# EasyEDA Pro project ProPrj_Pollux Marine Drone_2026-04-10.epro

# Schematic Headset
Board Name: Board1; Create Date: 2026-03-25; Page Name: P1; Project Name: Pollux Marine Drone; Schematic Name: Headset; Update Date: 2026-03-25; Company: EasyEDA.com; Page Size: A4; Version: V1.0
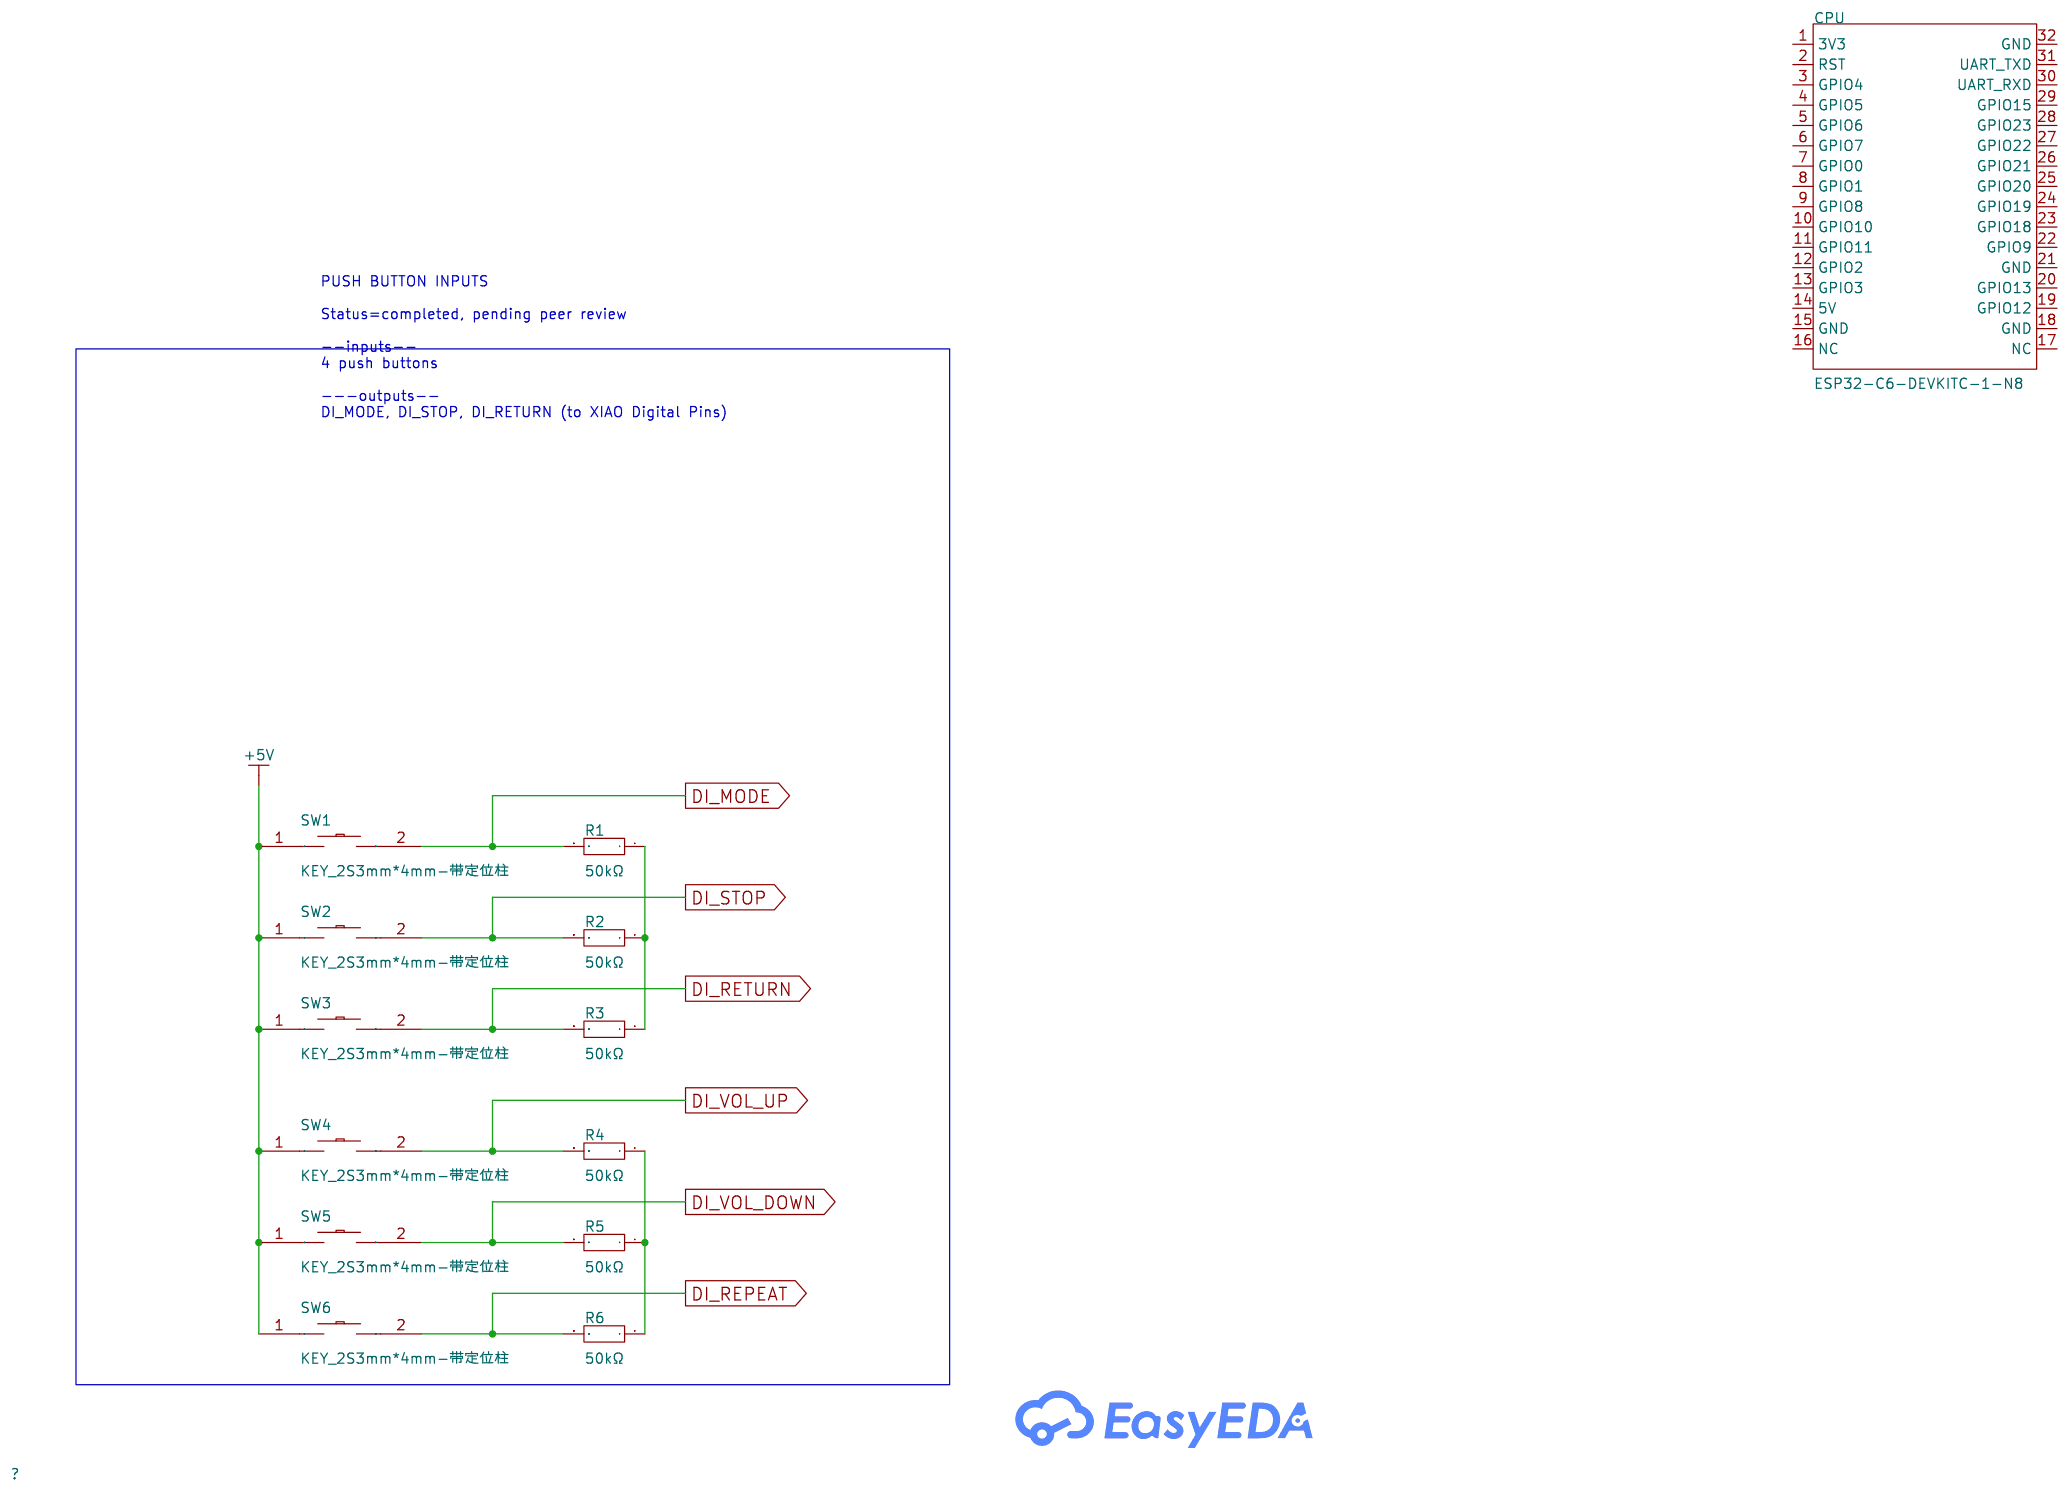
[diagram p0: schematic sheet]

## Parts
CPU  ESP32-C6-DEVKITC-1-N8  [COMM-TH_ESP32-C6-DEVKITC-1-N8]
R1  50kΩ  [R0805]
R2  50kΩ  [R0805]
R3  50kΩ  [R0805]
R4  50kΩ  [R0805]
R5  50kΩ  [R0805]
R6  50kΩ  [R0805]
SW1  KEY_2S3mm*4mm-带定位柱  [KEY-SMD_L4.0-W3.7-LS4.8]
SW2  KEY_2S3mm*4mm-带定位柱  [KEY-SMD_L4.0-W3.7-LS4.8]
SW3  KEY_2S3mm*4mm-带定位柱  [KEY-SMD_L4.0-W3.7-LS4.8]
SW4  KEY_2S3mm*4mm-带定位柱  [KEY-SMD_L4.0-W3.7-LS4.8]
SW5  KEY_2S3mm*4mm-带定位柱  [KEY-SMD_L4.0-W3.7-LS4.8]
SW6  KEY_2S3mm*4mm-带定位柱  [KEY-SMD_L4.0-W3.7-LS4.8]

## Library data of the parts
CPU = ESP32-C6-DEVKITC-1-N8: LCSC Part Name: 不带固件; Supplier Part: C20554022; Manufacturer: ESPRESSIF(乐鑫); JLCPCB Part Class: Extended Part; Datasheet: https://item.szlcsc.com/datasheet/ESP32-C6-DEVKITC-1-N8/21893411.html; Supplier: LCSC
R1-R6 = 0805W8F1002T5E: Type:Thick Film Resistor Resistance:10kΩ Tolerance:±1% Tolerance:±1% Power(Watts):125mW Voltage-Supply(Max):150V Temperature Coefficient:±100ppm/℃ Temperature Coefficient:±100ppm/℃ Operating Temperature:-55℃~+155℃ Operating Temperature:-55℃~+155℃; LCSC Part Name: 10kΩ ±1% 125mW 厚膜电阻; Supplier Part: C17414; Manufacturer: UNI-ROYAL(厚声); Supplier Footprint: 0805; JLCPCB Part Class: Basic Part; Datasheet: https://item.szlcsc.com/datasheet/0805W8F1002T5E/18102.html; Supplier: LCSC; Type: Thick Film Resistor; Tolerance: ±1%; Power(Watts): 125mW; Voltage-Supply(Max): 150V; Temperature Coefficient: ±100ppm/℃; Operating Temperature: -55℃~+155℃
SW1-SW6 = KEY_2S3mm*4mm-带定位柱: Supplier Part: C9900019844; Supplier Footprint: 二脚小乌龟SW_PUSH-带定位柱; JLCPCB Part Class: Extended Part; Supplier: LCSC

## Nets
+5V: SW1.1 SW2.1 SW3.1 SW4.1 SW5.1 SW6.1
GND: R1.1 R2.1 R3.1
DI_MODE: R1.2 SW1.2
DI_REPEAT: R6.2 SW6.2
DI_RETURN: R3.2 SW3.2
DI_STOP: R2.2 SW2.2
DI_VOL_DOWN: R5.2 SW5.2
DI_VOL_UP: R4.2 SW4.2
Net-(R4-1): R4.1 R5.1 R6.1

Not connected (* = marked no-connect by the designer): CPU 1(3V3) 2(RST) 3(GPIO4) 4(GPIO5) 5(GPIO6) 6(GPIO7) 7(GPIO0) 8(GPIO1) 9(GPIO8) 10(GPIO10) 11(GPIO11) 12(GPIO2) 13(GPIO3) 14(5V) 15(GND) 16(NC) 17(NC) 18(GND) 19(GPIO12) 20(GPIO13) 21(GND) 22(GPIO9) 23(GPIO18) 24(GPIO19) 25(GPIO20) 26(GPIO21) 27(GPIO22) 28(GPIO23) 29(GPIO15) 30(UART_RXD) 31(UART_TXD) 32(GND)

## Notes on the sheet
- PUSH BUTTON INPUTS
  Status=completed, pending peer review
  --inputs--
  4 push buttons
  ---outputs--
  DI_MODE, DI_STOP, DI_RETURN (to XIAO Digital Pins)

# Schematic Schematic1
Board Name: Wristband; Create Date: 2026-03-01; Page Name: P1; Project Name: Pollux Marine Drone; Schematic Name: Schematic1; Update Date: 2026-04-07; Company: EasyEDA.com; Page Size: A4; Version: V1.0
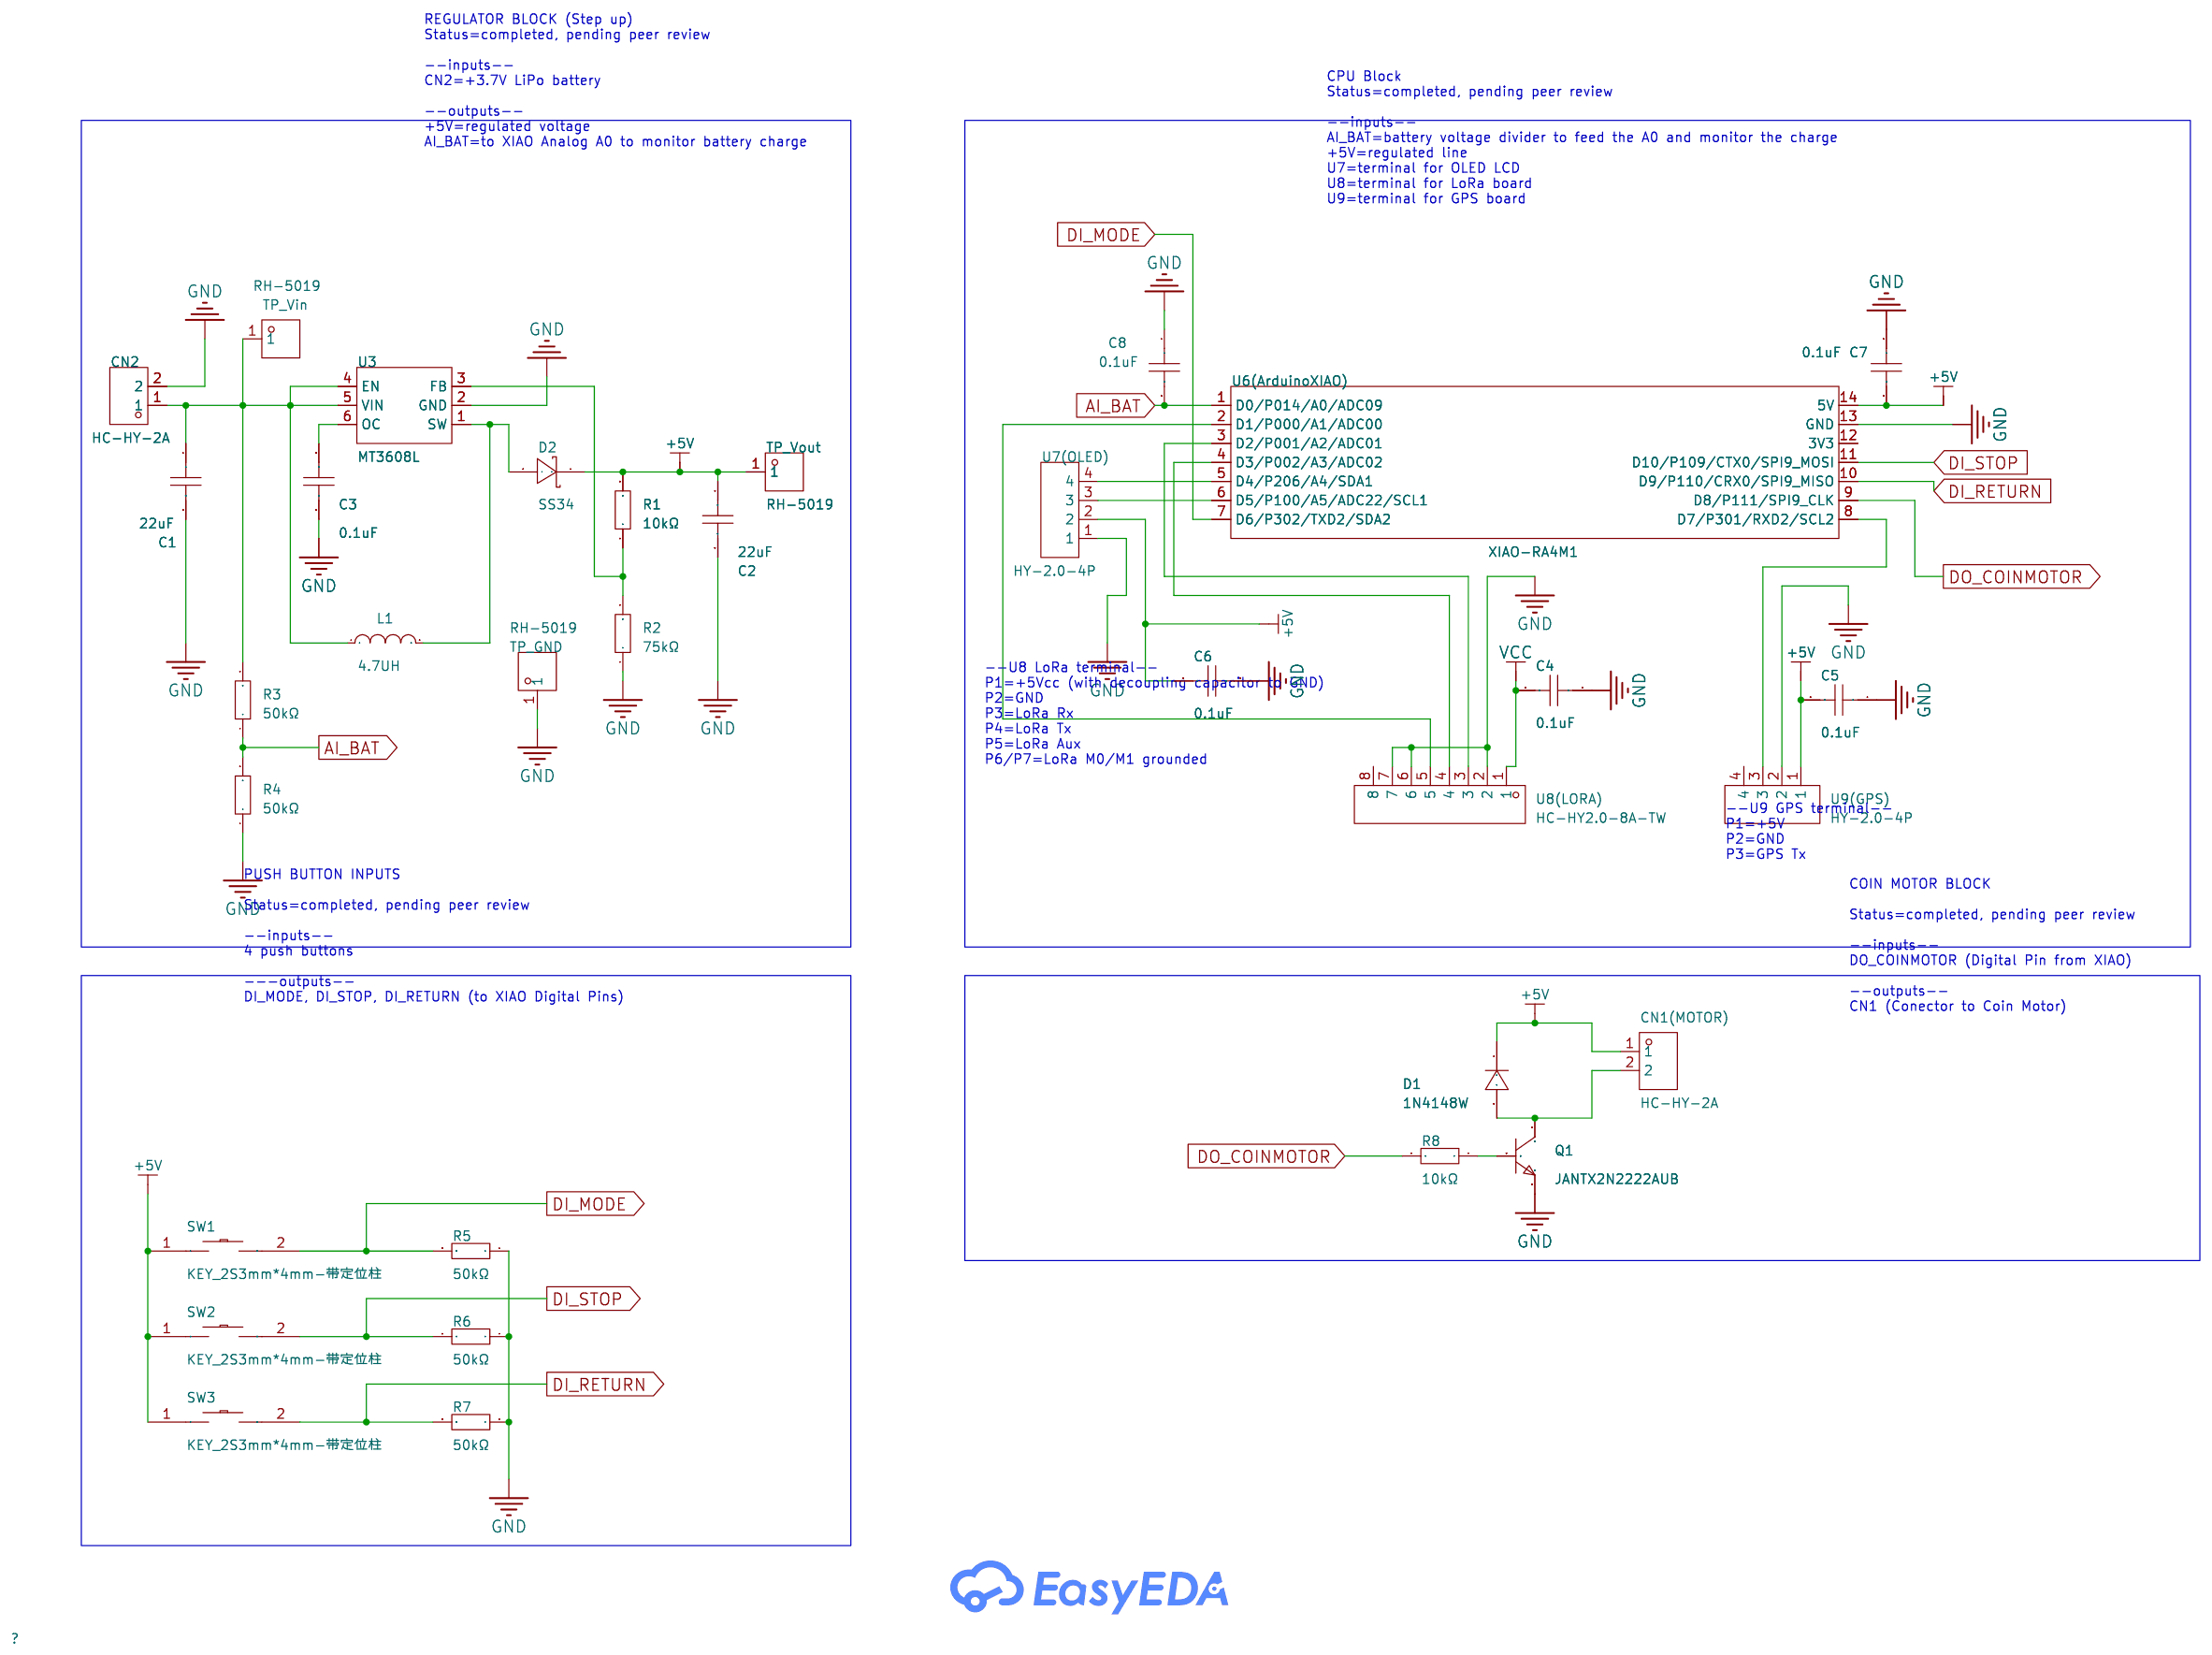
[diagram p1: schematic sheet]

## Parts
C1  22uF  [C0805]
C2  22uF  [C0805]
C3  0.1uF  [C0603]
C4  0.1uF  [C0603]
C5  0.1uF  [C0603]
C6  0.1uF  [C0603]
C7  0.1uF  [C0603]
C8  0.1uF  [C0603]
CN1(MOTOR)  HC-HY-2A  [CONN-TH_2P-P2.00_HCTL_HC-HY-2A]
CN2  HC-HY-2A  [CONN-TH_2P-P2.00_HCTL_HC-HY-2A]
D1  1N4148W  [SOD-123F_L2.7-W1.6-LS3.8-RD]
D2  SS34  [SMA_L4.3-W2.6-LS5.2-RD]
L1  4.7UH  [IND-SMD_L3.5-W3.0]
Q1  JANTX2N2222AUB  [SMD_3-L3.0-W2.5_JANTXV2N2222AUB]
R1  10kΩ  [R0805]
R2  75kΩ  [R0805]
R3  50kΩ  [R0805]
R4  50kΩ  [R0805]
R5  50kΩ  [R0805]
R6  50kΩ  [R0805]
R7  50kΩ  [R0805]
R8  10kΩ  [R0805]
SW1  KEY_2S3mm*4mm-带定位柱  [KEY-SMD_L4.0-W3.7-LS4.8]
SW2  KEY_2S3mm*4mm-带定位柱  [KEY-SMD_L4.0-W3.7-LS4.8]
SW3  KEY_2S3mm*4mm-带定位柱  [KEY-SMD_L4.0-W3.7-LS4.8]
TP_GND  RH-5019  [TESTPOINT-SMD_L3.8-W2.0_RH-5019]
TP_Vin  RH-5019  [TESTPOINT-SMD_L3.8-W2.0_RH-5019]
TP_Vout  RH-5019  [TESTPOINT-SMD_L3.8-W2.0_RH-5019]
U3  MT3608L  [SOT-23-6_L2.9-W1.6-P0.95-LS2.8-BL_3]
U6(ArduinoXIAO)  XIAO-RA4M1  [COMM-SMD_14P-L21.2-W17.8-P2.54-TL]
U7(OLED)  HY-2.0-4P  [CONN-TH_4P-P2.00_HX20020-4A]
U8(LORA)  HC-HY2.0-8A-TW  [HDR-TH_8P-P2.00-V-F-1]
U9(GPS)  HY-2.0-4P  [CONN-TH_4P-P2.00_HX20020-4A]

## Library data of the parts
C1 C2 = 0805X5R106K350NT: Capacitance:10uF Tolerance:±10% Tolerance:±10% Voltage Rating:35V Temperature Coefficient:X5R; LCSC Part Name: 10uF ±10% 35V; Supplier Part: C49326680; Manufacturer: AIDE(爱迪电容); Supplier Footprint: 0805; JLCPCB Part Class: Extended Part; Datasheet: https://item.szlcsc.com/datasheet/0805X5R106K350NT/51802510.html; Supplier: LCSC; Tolerance: ±10%; Voltage Rating: 35V; Temperature Coefficient: X5R
C3-C8 = TCC0603X7R334K250CT: Capacitance:330nF Tolerance:±10% Tolerance:±10% Voltage Rating:25V Temperature Coefficient:X7R; LCSC Part Name: 330nF ±10% 25V; Supplier Part: C48986350; Manufacturer: CCTC(三环); Supplier Footprint: 0603; JLCPCB Part Class: Extended Part; Datasheet: https://item.szlcsc.com/datasheet/TCC0603X7R334K250CT/51320361.html; Supplier: LCSC; Tolerance: ±10%; Voltage Rating: 25V; Temperature Coefficient: X7R
CN1(MOTOR) CN2 = HC-HY-2A: Pins Structure:1x2P Pitch:2mm Mounting Type:Through Hole Reference Series:HY Number of Pins:2P Number of Rows:1 Number of PINs Per Row:2 Row Spacing:- Current Rating:2A Contact Material:Brass Contact Plating:Tin Operating Temperature:-25℃~+85℃ Operating T; LCSC Part Name: 1x2P 间距:2mm 直插 系列:HY; Supplier Part: C2845460; Manufacturer: HCTL(华灿天禄); Supplier Footprint: 插件,P=2mm; JLCPCB Part Class: Extended Part; Datasheet: https://item.szlcsc.com/datasheet/HC-HY-2A/3039141.html; Supplier: LCSC; Pins Structure: 1x2P; Pitch: 2mm; Mounting Type: Through Hole; Reference Series: HY; Number of Pins: 2P; Number of Rows: 1; Number of PINs Per Row: 2; Current Rating: 2A; Contact Material: Brass; Contact Plating: Tin; Operating Temperature: -25℃~+85℃; Voltage Rating: 250V; Plastic Material: PA66; Color: White; Z-Height of the Board: 7.8mm; X-Length of Bottom Edge on Board (Spacing Line): 6mm; Y-Width of Bottom Edge on Board: 5.1mm
D1 = 1N4148W_C81598: Diode Configuration:Independent Voltage - Forward(Vf@If):1V@50mA Voltage - DC Reverse(Vr):75V Current - Rectified:150mA Pd - Power Dissipation:400mW Reverse Leakage Current (Ir):1uA@75V Reverse Recovery Time (trr):4ns Operating Junction Temperature Range:; Supplier Part: C81598; Manufacturer: ST(先科); Supplier Footprint: SOD-123; JLCPCB Part Class: Basic Part; Datasheet: https://item.szlcsc.com/datasheet/1N4148W/82750.html; Supplier: LCSC; Diode Configuration: Independent; Voltage - Forward(Vf@If): 1V@50mA; Voltage - DC Reverse(Vr): 75V; Current - Rectified: 150mA; Pd - Power Dissipation: 400mW; Reverse Leakage Current (Ir): 1uA@75V; Reverse Recovery Time (trr): 4ns; Non-Repetitive Peak Forward Surge Current: 1A
D2 = SS34_C8678: Diode Configuration:Independent Voltage - Forward(Vf@If):550mV@3A Voltage - DC Reverse(Vr):40V Current - Rectified:3A Reverse Leakage Current (Ir):500uA@40V Operating Junction Temperature Range:-55℃~+125℃ Operating Junction Temperature Range:-55℃~+125℃; LCSC Part Name: 电压:40V 电流:3A; Supplier Part: C8678; Manufacturer: MDD(辰达半导体); Supplier Footprint: SMA(DO-214AC); JLCPCB Part Class: Basic Part; Datasheet: https://item.szlcsc.com/datasheet/SS34/9178.html; Supplier: LCSC; Diode Configuration: Independent; Voltage - Forward(Vf@If): 550mV@3A; Voltage - DC Reverse(Vr): 40V; Current - Rectified: 3A; Reverse Leakage Current (Ir): 500uA@40V; Operating Junction Temperature Range: -55℃~+125℃
L1 = 4.7UH_C9900008595: Supplier Part: C9900008595; JLCPCB Part Class: Extended Part; Supplier: LCSC
Q1 = JANTX2N2222AUB: Transistor Type: Collector Current (Ic): Collector-Emitter Breakdown Voltage (Vceo): Power Dissipation (Pd):500mW DC Current Gain (hFE@Ic,Vce):30@0.1mA,10V DC Current Gain (hFE@Ic,Vce):30@0.1mA,10V Collector Cut-Off Current (Icbo):10uA Collector-Emitter S; LCSC Part Name: NPN 电流:800mA 耐压:50V; Supplier Part: C5658040; Manufacturer: MICROCHIP(美国微芯); Supplier Footprint: SMD-3P; JLCPCB Part Class: Extended Part; Datasheet: https://atta.szlcsc.com/upload/public/pdf/source/20230606/E4E4BB560E81A9B18723DFB9400D168A.pdf; Supplier: LCSC; Power Dissipation (Pd): 500mW; DC Current Gain (hFE@Ic,Vce): 30@0.1mA,10V; Collector Cut-Off Current (Icbo): 10uA; Collector-Emitter Saturation Voltage (VCE(sat)@Ic,Ib): 300mV@150mA,15mA; Operating Temperature: -65℃~+200℃
R1-R8 = 0805W8F1002T5E: Type:Thick Film Resistor Resistance:10kΩ Tolerance:±1% Tolerance:±1% Power(Watts):125mW Voltage-Supply(Max):150V Temperature Coefficient:±100ppm/℃ Temperature Coefficient:±100ppm/℃ Operating Temperature:-55℃~+155℃ Operating Temperature:-55℃~+155℃; LCSC Part Name: 10kΩ ±1% 125mW 厚膜电阻; Supplier Part: C17414; Manufacturer: UNI-ROYAL(厚声); Supplier Footprint: 0805; JLCPCB Part Class: Basic Part; Datasheet: https://item.szlcsc.com/datasheet/0805W8F1002T5E/18102.html; Supplier: LCSC; Type: Thick Film Resistor; Tolerance: ±1%; Power(Watts): 125mW; Voltage-Supply(Max): 150V; Temperature Coefficient: ±100ppm/℃; Operating Temperature: -55℃~+155℃
SW1-SW3 = KEY_2S3mm*4mm-带定位柱: Supplier Part: C9900019844; Supplier Footprint: 二脚小乌龟SW_PUSH-带定位柱; JLCPCB Part Class: Extended Part; Supplier: LCSC
TP_GND TP_Vin TP_Vout = RH-5019: Connector Type:Ferrite Ring (SMD) Plastic Color:Non-Plastic Board Space (Diameter φ/ Length x Width):3.8mmx2.03mm; LCSC Part Name: PCB电路板测试点/测试针; Supplier Part: C5199800; Manufacturer: 荣和; JLCPCB Part Class: Extended Part; Datasheet: https://item.szlcsc.com/datasheet/RH-5019/5885636.html; Supplier: LCSC; Connector Type: Ferrite Ring (SMD); Plastic Color: Non-Plastic; Board Space (Diameter φ/ Length x Width): 3.8mmx2.03mm
U3 = MT3608L: Function:Boost Voltage - Supply:2.2V~16V Voltage - Supply:2.2V~16V Output Voltage:- Output Voltage:- Output Current:2.5A Frequency - Switching:1.2MHz Frequency - Switching:1.2MHz Operating Temperature:-40℃~+85℃@(TA) Operating Temperature:-40℃~+85℃@(TA) Sy; LCSC Part Name: 高效2.5A 1.2MHz升压转换器; Supplier Part: C2932326; Manufacturer: 西安航天民芯; Supplier Footprint: SOT-23-6; JLCPCB Part Class: Extended Part; Datasheet: https://item.szlcsc.com/datasheet/MT3608L/3276649.html; Supplier: LCSC; Function: Boost; Voltage - Supply: 2.2V~16V; Output Current: 2.5A; Frequency - Switching: 1.2MHz; Operating Temperature: -40℃~+85℃@(TA); Synchronous Rectifier: No; Number of Outputs: 1; Topology: Boost; Quiescent Current: 100uA; Switch tube (built-in/external): Built-In; Output Type: Adjustable
U6(ArduinoXIAO) = XIAO-RA4M1: Supplier Part: C9900180491; Supplier Footprint: LCC-14; JLCPCB Part Class: Extended Part; Supplier: LCSC
U7(OLED) U9(GPS) = HY-2.0-4P: Supplier Part: C9900020216; Supplier Footprint: CONN-TH_4P-P2.00; JLCPCB Part Class: Extended Part; Supplier: LCSC
U8(LORA) = HC-HY2.0-8A-TW: Pins Structure:1x8P Pitch:2mm Mounting Type:Through Hole Reference Series:HY Number of Pins:8P Number of Rows:1 Number of PINs Per Row:8 Row Spacing:- Current Rating:1A Contact Material:Copper Contact Plating:Tin Operating Temperature:-25℃~+85℃ Operating; LCSC Part Name: 1x8P 间距:2mm 直插 系列:HY; Supplier Part: C19273688; Manufacturer: HC(虹成电子); Supplier Footprint: 插件,P=2mm; Datasheet: https://item.szlcsc.com/datasheet/HC-HY2.0-8A-TW/20558288.html; Supplier: LCSC; Pins Structure: 1x8P; Pitch: 2mm; Mounting Type: Through Hole; Reference Series: HY; Number of Pins: 8P; Number of Rows: 1; Number of PINs Per Row: 8; Current Rating: 1A; Contact Material: Copper; Contact Plating: Tin; Operating Temperature: -25℃~+85℃; Voltage Rating: 200V; Plastic Material: PA66; Color: White; Z-Height of the Board: 8mm; X-Length of Bottom Edge on Board (Spacing Line): 18mm; Y-Width of Bottom Edge on Board: 5.15mm

## Nets
+5V: C2.1 C5.2 C6.2 C7.2 CN1(MOTOR).1 D1.1(K) D2.1(K) R1.2 SW1.1 SW2.1 SW3.1 TP_Vout.1 U6(ArduinoXIAO).14(5V) U7(OLED).2 U9(GPS).1
GND: C1.2 C2.2 C3.1 C4.1 C5.1 C6.1 C7.1 C8.1 CN2.2 Q1.2(E) R2.1 R4.1 R5.1 R6.1 R7.1 TP_GND.1 U3.2(GND) U6(ArduinoXIAO).13(GND) U7(OLED).1 U8(LORA).2 U8(LORA).6 U8(LORA).7 U9(GPS).2
VCC: C4.2 U8(LORA).1
AI_BAT: C8.2 R3.1 R4.2 U6(ArduinoXIAO).1(D0/P014/A0/ADC09)
DI_MODE: R5.2 SW1.2 U6(ArduinoXIAO).7(D6/P302/TXD2/SDA2)
DI_RETURN: R7.2 SW3.2 U6(ArduinoXIAO).10(D9/P110/CRX0/SPI9_MISO)
DI_STOP: R6.2 SW2.2 U6(ArduinoXIAO).11(D10/P109/CTX0/SPI9_MOSI)
DO_COINMOTOR: R8.2 U6(ArduinoXIAO).9(D8/P111/SPI9_CLK)
$1N1057: C1.1 CN2.1 L1.1 R3.2 TP_Vin.1 U3.4(EN) U3.5(VIN)
$1N1129: R1.1 R2.2 U3.3(FB)
$1N1619: C3.2 U3.6(OC)
$1N3128: U6(ArduinoXIAO).5(D4/P206/A4/SDA1) U7(OLED).4
$1N3132: U6(ArduinoXIAO).6(D5/P100/A5/ADC22/SCL1) U7(OLED).3
$1N3760: U6(ArduinoXIAO).3(D2/P001/A2/ADC01) U8(LORA).3
$1N3779: U6(ArduinoXIAO).2(D1/P000/A1/ADC00) U8(LORA).5
$1N3915: U6(ArduinoXIAO).4(D3/P002/A3/ADC02) U8(LORA).4
$1N4023: U6(ArduinoXIAO).8(D7/P301/RXD2/SCL2) U9(GPS).3
$1N4670: Q1.3(B) R8.1
$1N4823: CN1(MOTOR).2 D1.2(A) Q1.1(C)
$1N7797: D2.2(A) L1.2 U3.1(SW)

Not connected (* = marked no-connect by the designer): U6(ArduinoXIAO) 12(3V3); U8(LORA) 8; U9(GPS) 4

## Notes on the sheet
- REGULATOR BLOCK (Step up)
  Status=completed, pending peer review
  --inputs--
  CN2=+3.7V LiPo battery
  --outputs--
  +5V=regulated voltage
  AI_BAT=to XIAO Analog A0 to monitor battery charge
- CPU Block
  Status=completed, pending peer review
  --inputs--
  AI_BAT=battery voltage divider to feed the A0 and monitor the charge
  +5V=regulated line
  U7=terminal for OLED LCD
  U8=terminal for LoRa board
  U9=terminal for GPS board
- --U8 LoRa terminal--
  P1=+5Vcc (with decoupling capacitor to GND)
  P2=GND
  P3=LoRa Rx
  P4=LoRa Tx
  P5=LoRa Aux
  P6/P7=LoRa M0/M1 grounded
- --U9 GPS terminal--
  P1=+5V
  P2=GND
  P3=GPS Tx
- PUSH BUTTON INPUTS
  Status=completed, pending peer review
  --inputs--
  4 push buttons
  ---outputs--
  DI_MODE, DI_STOP, DI_RETURN (to XIAO Digital Pins)
- COIN MOTOR BLOCK
  Status=completed, pending peer review
  --inputs--
  DO_COINMOTOR (Digital Pin from XIAO)
  --outputs--
  CN1 (Conector to Coin Motor)

# Board PCB3
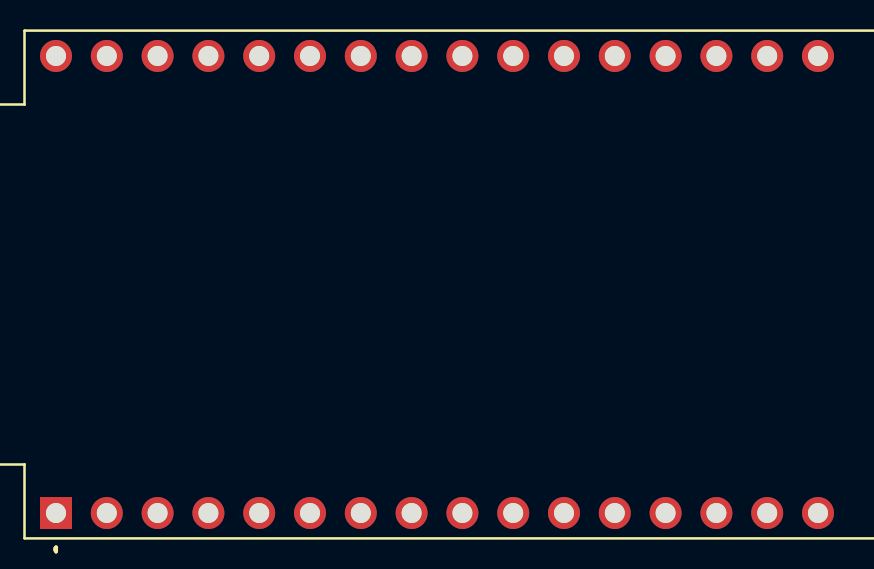
[diagram p2: board, top side]
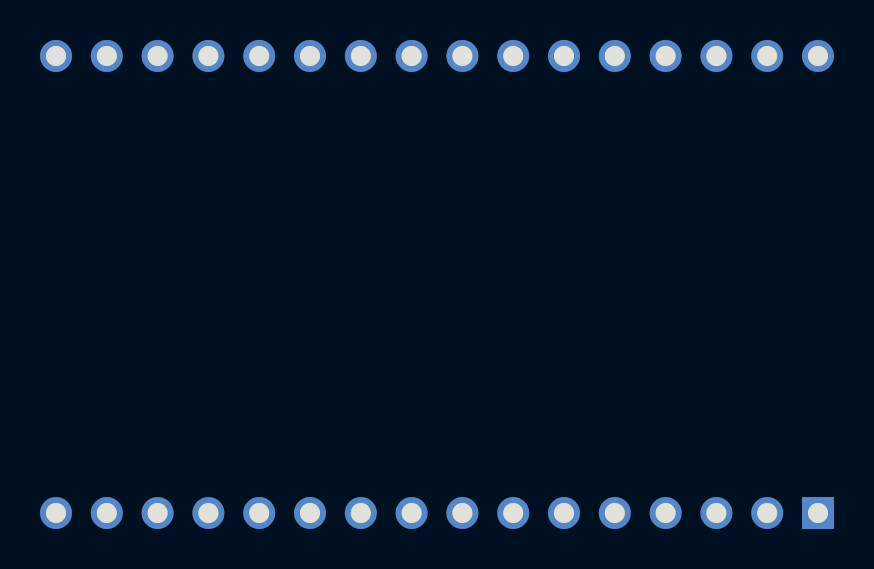
[diagram p3: board, bottom side, seen from below]

No outline. copper layers: Top Layer, Bottom Layer. Coordinates in mm from the lowest, leftmost part position.
Stack: Top Layer 0.035mm / Dielectric1 1.51mm FR4 er 4.5 / Bottom Layer 0.035mm

## Design rules (mm)
template: JLCPCB Capability(Two Layers Board)
spacing copperThickness1oz (default): track to track 0.102, other pairs 0.152 to 0.3
spacing copperThickness2oz: track to track 0.203, other pairs 0.152 to 0.3
track width copperThickness1oz (default): min 0.127, default 0.254, max 2.54
track width copperThickness2oz: min 0.203, default 0.254, max 2.54
differential pair differentialPair (default): width min 0.127, default 0.254, max 2.54; gap min 0.152, default 0.152
via viaSize (default): diameter min 0.5, default 0.61, max 10; hole min 0.3, default 0.305, max 6.3

## Placement (name value [footprint] x y rotation side)
U4  ESP32-C6-DEVKITC-1-N8  [COMM-TH_ESP32-C6-DEVKITC-1-N8]  0 0 90 top

## Footprints (pads in the part's own frame, mm; a bottom-side part is the same pattern mirrored in y, then rotated)
COMM-TH_ESP32-C6-DEVKITC-1-N8
  rect 1.6x1.6 hole 1: 1(-11.43,19.05)
  round 1.6 hole 1: 2(-11.43,16.51) 3(-11.43,13.97) 4(-11.43,11.43) 5(-11.43,8.89) 6(-11.43,6.35) 7(-11.43,3.81) 8(-11.43,1.27) 9(-11.43,-1.27) 10(-11.43,-3.81) 11(-11.43,-6.35) 12(-11.43,-8.89) 13(-11.43,-11.43) 14(-11.43,-13.97) 15(-11.43,-16.51) 16(-11.43,-19.05) 17(11.43,-19.05) 18(11.43,-16.51) 19(11.43,-13.97) 20(11.43,-11.43) 21(11.43,-8.89) 22(11.43,-6.35) 23(11.43,-3.81) 24(11.43,-1.27) 25(11.43,1.27) 26(11.43,3.81) 27(11.43,6.35) 28(11.43,8.89) 29(11.43,11.43) 30(11.43,13.97) 31(11.43,16.51) 32(11.43,19.05)

## Nets
As in the schematic.

Pads without a net: U4 1 2 3 4 5 6 7 8 9 10 11 12 13 14 15 16 17 18 19 20 21 22 23 24 25 26 27 28 29 30 31 32

# Board PCB2
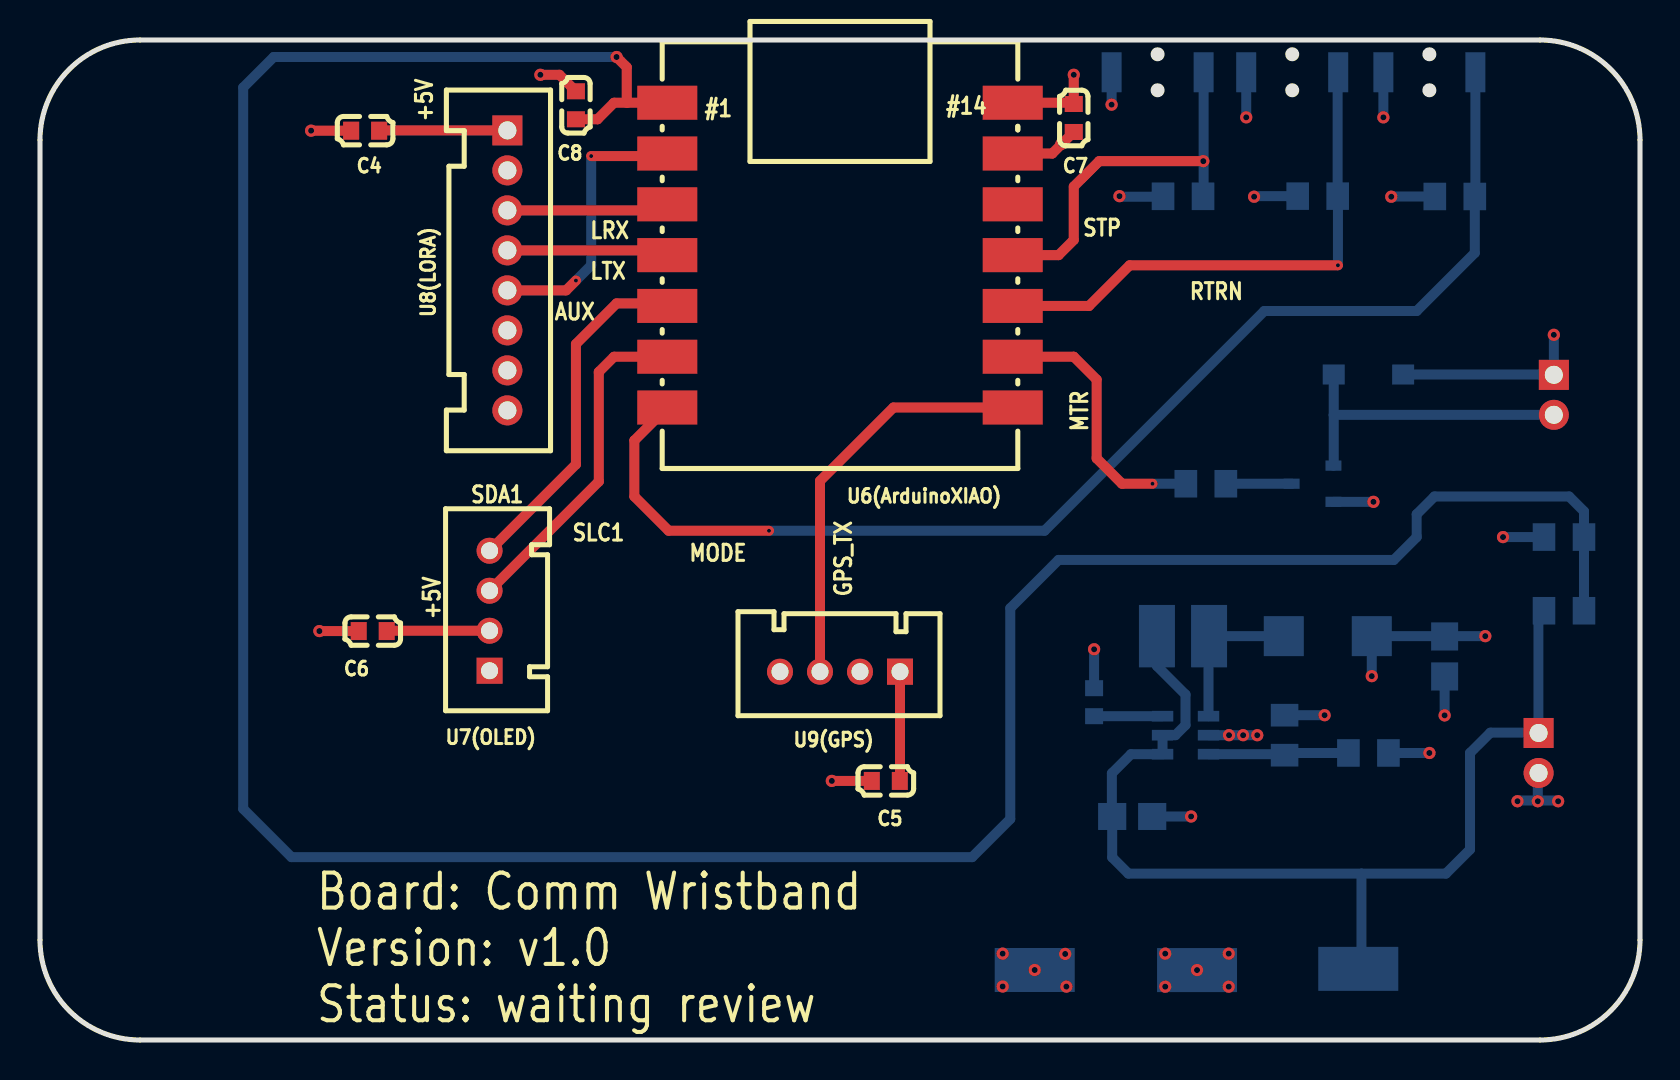
[diagram p4: board, top side]
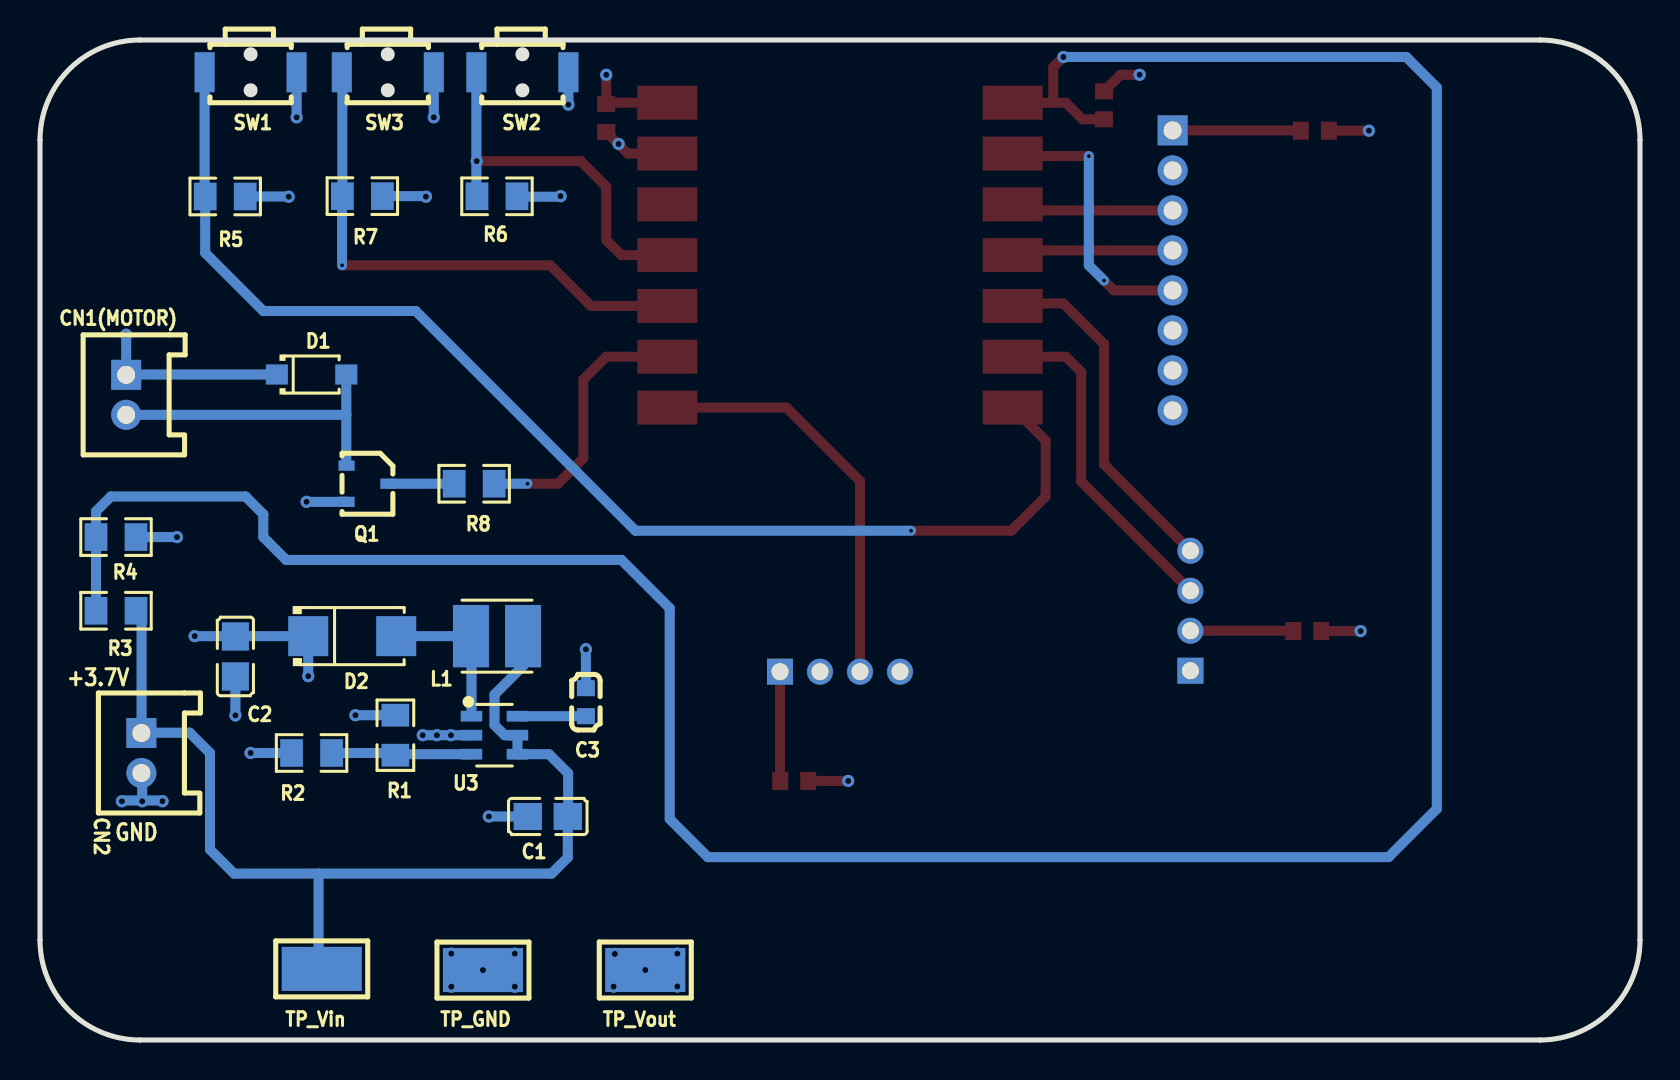
[diagram p5: board, bottom side, seen from below]

Outline 80 x 50 mm; copper layers: Top Layer, Inner1_GND, Inner2_VCC, Bottom Layer. Coordinates in mm from the lower left corner of the outline.
Outline path: 0,45 0,5 arc(1.46,1.46) 5,0 75,0 arc(78.54,1.46) 80,5 80,45 arc(78.54,48.54) 75,50 5,50 arc(1.46,48.54) 0,45
Stack: Top Layer 0.035mm Outer layer thickness 1oz / Dielectric1 0.2104mm 7628 RC49% 8.6mil / Inner1_GND 0.0152mm Inner layer thickness / Dielectric2 1.065mm 1.1mm H/HOZ Copper / Inner2_VCC 0.0152mm Inner layer thickness / Dielectric3 0.2104mm 7628 RC49% 8.6mil / Bottom Layer 0.035mm Outer layer thickness 1oz

## Design rules (mm)
template: Custom Config
spacing copperThickness1oz (default): track to track 0.102, other pairs 0.152 to 0.3
spacing copperThickness2oz: track to track 0.203, other pairs 0.152 to 0.3
track width copperThickness1oz (default): min 0.127, default 0.5, max 2.54
track width copperThickness2oz: min 0.203, default 0.254, max 2.54
differential pair differentialPair (default): width min 0.127, default 0.254, max 2.54; gap min 0.152, default 0.152
via powerSize (default): diameter min 0.5, default 0.61, max 10; hole min 0.3, default 0.305, max 6.3
via signalSize: diameter min 0.45, default 0.45, max 10; hole min 0.1, default 0.2, max 6.3
net $1N1057 uses signalSize
net $1N1619 uses signalSize
net $1N4823 uses signalSize
net $1N4670 uses signalSize
net $1N1129 uses signalSize
net AI_BAT uses signalSize
net DI_MODE uses signalSize
net DI_STOP uses signalSize
net DI_RETURN uses signalSize
net DO_COINMOTOR uses signalSize
net $1N3779 uses signalSize
net $1N3760 uses signalSize
net $1N3915 uses signalSize
net $1N3128 uses signalSize
net $1N3132 uses signalSize
net $1N4023 uses signalSize
net $1N7797 uses signalSize

## Placement (name value [footprint] x y rotation side)
C1  22uF  [C0805]  54.61 11.18 0 bottom
C2  22uF  [C0805]  70.23 19.18 270 bottom
C3  0.1uF  [C0603]  52.71 16.89 270 bottom
C4  0.1uF  [C0603]  16.26 45.47 0 top
C5  0.1uF  [C0603]  42.29 12.95 0 top
C6  0.1uF  [C0603]  16.64 20.45 0 top
C7  0.1uF  [C0603]  51.69 46.1 90 top
C8  0.1uF  [C0603]  26.8 46.74 270 top
CN1(MOTOR)  HC-HY-2A  [CONN-TH_2P-P2.00_HCTL_HC-HY-2A]  75.69 32.26 90 bottom
CN2  HC-HY-2A  [CONN-TH_2P-P2.00_HCTL_HC-HY-2A]  74.93 14.35 90 bottom
D1  1N4148W  [SOD-123F_L2.7-W1.6-LS3.8-RD]  66.42 33.27 180 bottom
D2  SS34  [SMA_L4.3-W2.6-LS5.2-RD]  64.39 20.19 180 bottom
L1  4.7UH  [IND-SMD_L3.5-W3.0]  57.15 20.19 180 bottom
Q1  JANTX2N2222AUB  [SMD_3-L3.0-W2.5_JANTXV2N2222AUB]  63.63 27.81 270 bottom
R1  10kΩ  [R0805]  62.23 15.24 90 bottom
R2  75kΩ  [R0805]  66.42 14.35 180 bottom
R3  50kΩ  [R0805]  76.2 21.46 180 bottom
R4  50kΩ  [R0805]  76.2 25.15 0 bottom
R5  50kΩ  [R0805]  70.74 42.18 0 bottom
R6  50kΩ  [R0805]  57.15 42.19 0 bottom
R7  50kΩ  [R0805]  63.88 42.19 0 bottom
R8  10kΩ  [R0805]  58.29 27.81 180 bottom
SW1  KEY_2S3mm*4mm-带定位柱  [KEY-SMD_L4.0-W3.7-LS4.8]  69.47 48.39 0 bottom
SW2  KEY_2S3mm*4mm-带定位柱  [KEY-SMD_L4.0-W3.7-LS4.8]  55.88 48.39 0 bottom
SW3  KEY_2S3mm*4mm-带定位柱  [KEY-SMD_L4.0-W3.7-LS4.8]  62.61 48.39 0 bottom
TP_GND  RH-5019  [TESTPOINT-SMD_L3.8-W2.0_RH-5019]  57.85 3.5 180 bottom
TP_Vin  RH-5019  [TESTPOINT-SMD_L3.8-W2.0_RH-5019]  65.91 3.56 180 bottom
TP_Vout  RH-5019  [TESTPOINT-SMD_L3.8-W2.0_RH-5019]  49.74 3.5 180 bottom
U3  MT3608L  [SOT-23-6_L2.9-W1.6-P0.95-LS2.8-BL_3]  57.28 15.24 270 bottom
U6(ArduinoXIAO)  XIAO-RA4M1  [COMM-SMD_14P-L21.2-W17.8-P2.54-TL]  40 39.24 0 top
U7(OLED)  HY-2.0-4P  [CONN-TH_4P-P2.00_HX20020-4A]  22.48 21.46 90 top
U8(LORA)  HC-HY2.0-8A-TW  [HDR-TH_8P-P2.00-V-F-1]  23.37 38.48 270 top
U9(GPS)  HY-2.0-4P  [CONN-TH_4P-P2.00_HX20020-4A]  40 18.42 180 top

## Footprints (pads in the part's own frame, mm; a bottom-side part is the same pattern mirrored in y, then rotated)
C0603
  rect 0.8x0.9 smd: 1(-0.7,0) 2(0.7,0)
C0805
  rect 1.41x1.35 smd: 1(-1,0) 2(1,0)
COMM-SMD_14P-L21.2-W17.8-P2.54-TL
  rect 3x1.7 smd: 1(-8.636,7.62) 2(-8.636,5.08) 3(-8.636,2.54) 4(-8.636,0) 5(-8.636,-2.54) 6(-8.636,-5.08) 7(-8.636,-7.62) 8(8.636,-7.62) 9(8.636,-5.08) 10(8.636,-2.54) 11(8.636,0) 12(8.636,2.54) 13(8.636,5.08) 14(8.636,7.62)
CONN-TH_2P-P2.00_HCTL_HC-HY-2A
  rect 1.5x1.5 hole 0.9: 1(1,0)
  round 1.5 hole 0.9: 2(-1,0)
CONN-TH_4P-P2.00_HX20020-4A
  rect 1.3x1.3 hole 0.85: 1(-3,0)
  round 1.3 hole 0.85: 2(-1,0) 3(1,0) 4(3,0)
HDR-TH_8P-P2.00-V-F-1
  rect 1.5x1.5 hole 0.9: 1(-7,0)
  round 1.5 hole 0.9: 2(-5,0) 3(-3,0) 4(-1,0) 5(1,0) 6(3,0) 7(5,0) 8(7,0)
IND-SMD_L3.5-W3.0
  rect 1.8x3.12 smd: 1(1.303,0) 2(-1.303,0)
KEY-SMD_L4.0-W3.7-LS4.8
  rect 1x2 smd: 1(-2.3,0) 2(2.3,0)
R0805
  rect 1.133x1.377 smd: 1(-1,0) 2(1,0)
SMA_L4.3-W2.6-LS5.2-RD
  rect 2x2 smd: 1(-2.2,0) 2(2.2,0)
SMD_3-L3.0-W2.5_JANTXV2N2222AUB
  rect 0.51x0.8 smd: 1(-0.905,-1.045) 2(0.905,-1.045) 3(0,1.045)
SOD-123F_L2.7-W1.6-LS3.8-RD
  rect 1.1x1 smd: 1(-1.735,0) 2(1.735,0)
SOT-23-6_L2.9-W1.6-P0.95-LS2.8-BL_3
  rect 0.532x1.072 smd: 1(-0.95,-1.149) 2(0,-1.149) 3(0.95,-1.149) 4(0.95,1.149) 5(0,1.149) 6(-0.95,1.149)
TESTPOINT-SMD_L3.8-W2.0_RH-5019
  rect 4x2.2 smd: 1(0,0)

## Nets
As in the schematic.

Pads without a net: U6(ArduinoXIAO) 12; U8(LORA) 8; U9(GPS) 4

## Via types
v1: diameter 0.61, hole 0.305, Top Layer to Bottom Layer, 40 vias
v2: diameter 0.45, hole 0.2, Top Layer to Bottom Layer, 5 vias

## Routing (per net, layer and track width the routed paths; a pad name or vN(x,y) marks a point on that pad's centre or on a via; arc(x,y) is an arc through that point)
+5V: length 40.5
  Top Layer w0.5: C5.2 43,12.96 U9(GPS).1 ; U7(OLED).2 17.35,20.46 C6.2 ; v1(51.69,48.26) C7.2 51.63,46.86 U6(ArduinoXIAO).14
  Bottom Layer w0.5: 70.22,20.2 70.23,20.19 ; v1(66.59,18.19) D2.1 70.22,20.19 ; 75.69,33.31 75.69,35.31 ; D1.1 75.68,33.27 CN1(MOTOR).1 ; 60.31,48.39 v1(60.31,46.13) ; R1.2 v1(64.23,16.24) ; 70.32,20.19 72.32,20.19 ; SW1.1 v1(67.17,46.13) ; SW2.1 v1(53.58,46.77)
  vias: v1(48.13,4.32) v1(48.13,2.68) v1(49.74,3.5) v1(51.26,4.3) v1(51.32,2.67) v1(72.26,20.19) v1(75.69,35.26)
GND: length 35.7
  Top Layer w0.5: v1(25.02,48.26) 25.97,48.26 C8.1 ; U6(ArduinoXIAO).13 50.61,44.32 C7.1 ; C4.1 v1(13.56,45.47) ; C6.1 13.94,20.45 ; C5.1 v1(39.59,12.95)
  Bottom Layer w0.5: 74.92,13.35 74.89,13.32 74.89,11.98 ; 67.52,14.35 69.52,14.35 ; U3.2 v1(59.45,15.24) v1(60.16,15.24) v1(60.86,15.24) ; C2.2 70.23,16.18 ; v1(74.89,11.94) 74.89,11.98 ; 74.89,11.98 73.87,11.98 ; 74.89,11.98 75.87,11.98 75.91,11.93 ; 62.65,42.19 60.65,42.19 ; C3.1 52.71,19.59 ; v1(67.56,42.16) 67.58,42.18 R5.1 ; 53.92,42.16 55.92,42.16 ; C1.2 57.61,11.18 ; 75.1,25.15 v1(73.15,25.15) ; Q1.2 v1(66.67,26.91)
  vias: v1(13.97,20.45) v1(51.07,44.8) v1(52.71,19.54) v1(53.97,42.19) v1(56.26,4.32) v1(56.26,2.67) v1(57.56,11.18) v1(57.85,3.5) v1(59.44,4.32) v1(59.44,2.67) v1(60.71,42.16) v1(69.47,14.35) v1(70.23,16.23) v1(73.87,11.94) v1(75.91,11.94)
VCC: length 6.5
  Top Layer w0.5: U8(LORA).1 17.07,45.48 16.96,45.59
AI_BAT: length 150.4
  Top Layer w0.5: C8.2 27.88,46.04 28.7,46.86 29.34,46.86 ; v1(28.83,49.15) 29.34,48.64 29.34,46.86 ; 29.34,46.86 U6(ArduinoXIAO).1
  Bottom Layer w0.5: R3.1 R4.2 77.2,26.43 76.45,27.18 69.72,27.18 68.83,26.29 68.83,25.15 67.69,24 50.93,24 48.51,21.59 48.51,11.05 46.61,9.14 12.57,9.14 10.16,11.56 10.16,47.62 11.68,49.15 v1(28.83,49.15)
DI_MODE: length 62.7
  Top Layer w0.5: 31.36,31.62 29.72,29.98 29.72,27.18 31.43,25.46 v2(36.45,25.46)
  Bottom Layer w0.5: v2(36.45,25.46) 50.23,25.46 61.21,36.45 68.83,36.45 71.74,39.36 R5.2 71.77,42.21 SW1.2
DI_RETURN: length 26.8
  Top Layer w0.5: 48.64,36.7 52.45,36.7 54.48,38.73 v2(64.9,38.73)
  Bottom Layer w0.5: v2(64.9,38.73) 64.9,42.18 R7.2 64.88,48.36 SW3.2
DI_STOP: length 19.3
  Top Layer w0.5: U6(ArduinoXIAO).11 50.93,39.24 51.69,40 51.69,42.67 52.96,43.94 v1(58.17,43.94)
  Bottom Layer w0.5: R6.2 58.18,42.21 SW2.2
DO_COINMOTOR: length 13.6
  Top Layer w0.5: v2(55.63,27.81) 54.1,27.81 52.83,29.08 52.83,33.02 51.69,34.16 U6(ArduinoXIAO).9
  Bottom Layer w0.5: R8.2 v2(55.63,27.81)
$1N1057: length 52.9
  Bottom Layer w0.5: 66.07,8.32 66.07,3.72 TP_Vin.1 ; 66.07,8.32 70.29,8.32 71.5,9.53 71.5,14.35 72.52,15.37 74.91,15.37 74.92,15.35 74.92,21.18 R3.2 ; 66.07,8.32 54.42,8.32 53.61,9.13 C1.1 53.59,11.19 53.59,13.33 54.55,14.29 U3.4 U3.5 56.77,15.24 57.28,15.75 57.28,17.27 55.85,18.7 L1.1
$1N1129: length 7.1
  Bottom Layer w0.5: R2.2 62.34,14.35 R1.1 62.18,14.29 U3.3
$1N1619: length 3.4
  Bottom Layer w0.5: U3.6 52.71,16.19
$1N3128: length 17.6
  Top Layer w0.5: U7(OLED).4 26.8,28.78 26.8,34.8 28.83,36.83 31.24,36.83 31.36,36.7
$1N3132: length 16.9
  Top Layer w0.5: U6(ArduinoXIAO).6 28.7,34.16 27.94,33.4 27.94,27.92 U7(OLED).3
$1N3760: length 8.1
  Top Layer w0.5: U8(LORA).3 31.06,41.48 U6(ArduinoXIAO).3
$1N3779: length 14
  Top Layer w0.5: U6(ArduinoXIAO).2 31.24,44.2 v2(27.56,44.2) ; v2(26.8,37.97) 26.31,37.48 U8(LORA).5
  Bottom Layer w0.5: v2(26.8,37.97) 27.56,38.73 v2(27.56,44.2)
$1N3915: length 8.1
  Top Layer w0.5: U6(ArduinoXIAO).4 31.13,39.48 U8(LORA).4
$1N4023: length 20.7
  Top Layer w0.5: 48.64,31.62 42.67,31.62 39,27.95 U9(GPS).3
$1N4670: length 3.3
  Bottom Layer w0.5: Q1.3 R8.1
$1N4823: length 15.6
  Bottom Layer w0.5: Q1.1 64.69,28.73 64.69,31.25 ; 64.69,31.25 64.69,31.26 CN1(MOTOR).2 ; 64.69,31.25 D1.2
$1N7797: length 7.8
  Bottom Layer w0.5: 62.19,20.19 L1.2 58.43,20.17 U3.1

## Copper pours and planes (outline as drawn; the poured copper is in the pictures)
+5V on Inner2_VCC: 0.26,49.74 79.74,49.74 79.74,0.26 0.26,0.26
GND on Inner1_GND: 0.26,49.74 79.74,49.74 79.74,0.26 0.26,0.26

Small or netless copper shapes (teardrops, artwork), in the pictures only: 17 on Inner1_GND, 11 on Inner2_VCC

## Text on the board
Bottom Silkscreen Layer: GND | +3.7V
Top Silkscreen Layer: SDA1 | AUX | SLC1 | LRX | LTX | MODE | #1 | #14 | RTRN | MTR | STP | GPS_TX | +5V | Board: Comm Wristband / Version: v1.0 / Status: waiting review
